# EasyEDA Pro project SCH.eprj

# Schematic Schematic1
Board Name: Board1; Create Date: 2025-12-10; Page Name: P1; Project Name: TestTask; Schematic Name: Schematic1; Update Date: 2025-12-11; Company: EasyEDA.com; Page Size: A4; Version: V1.0
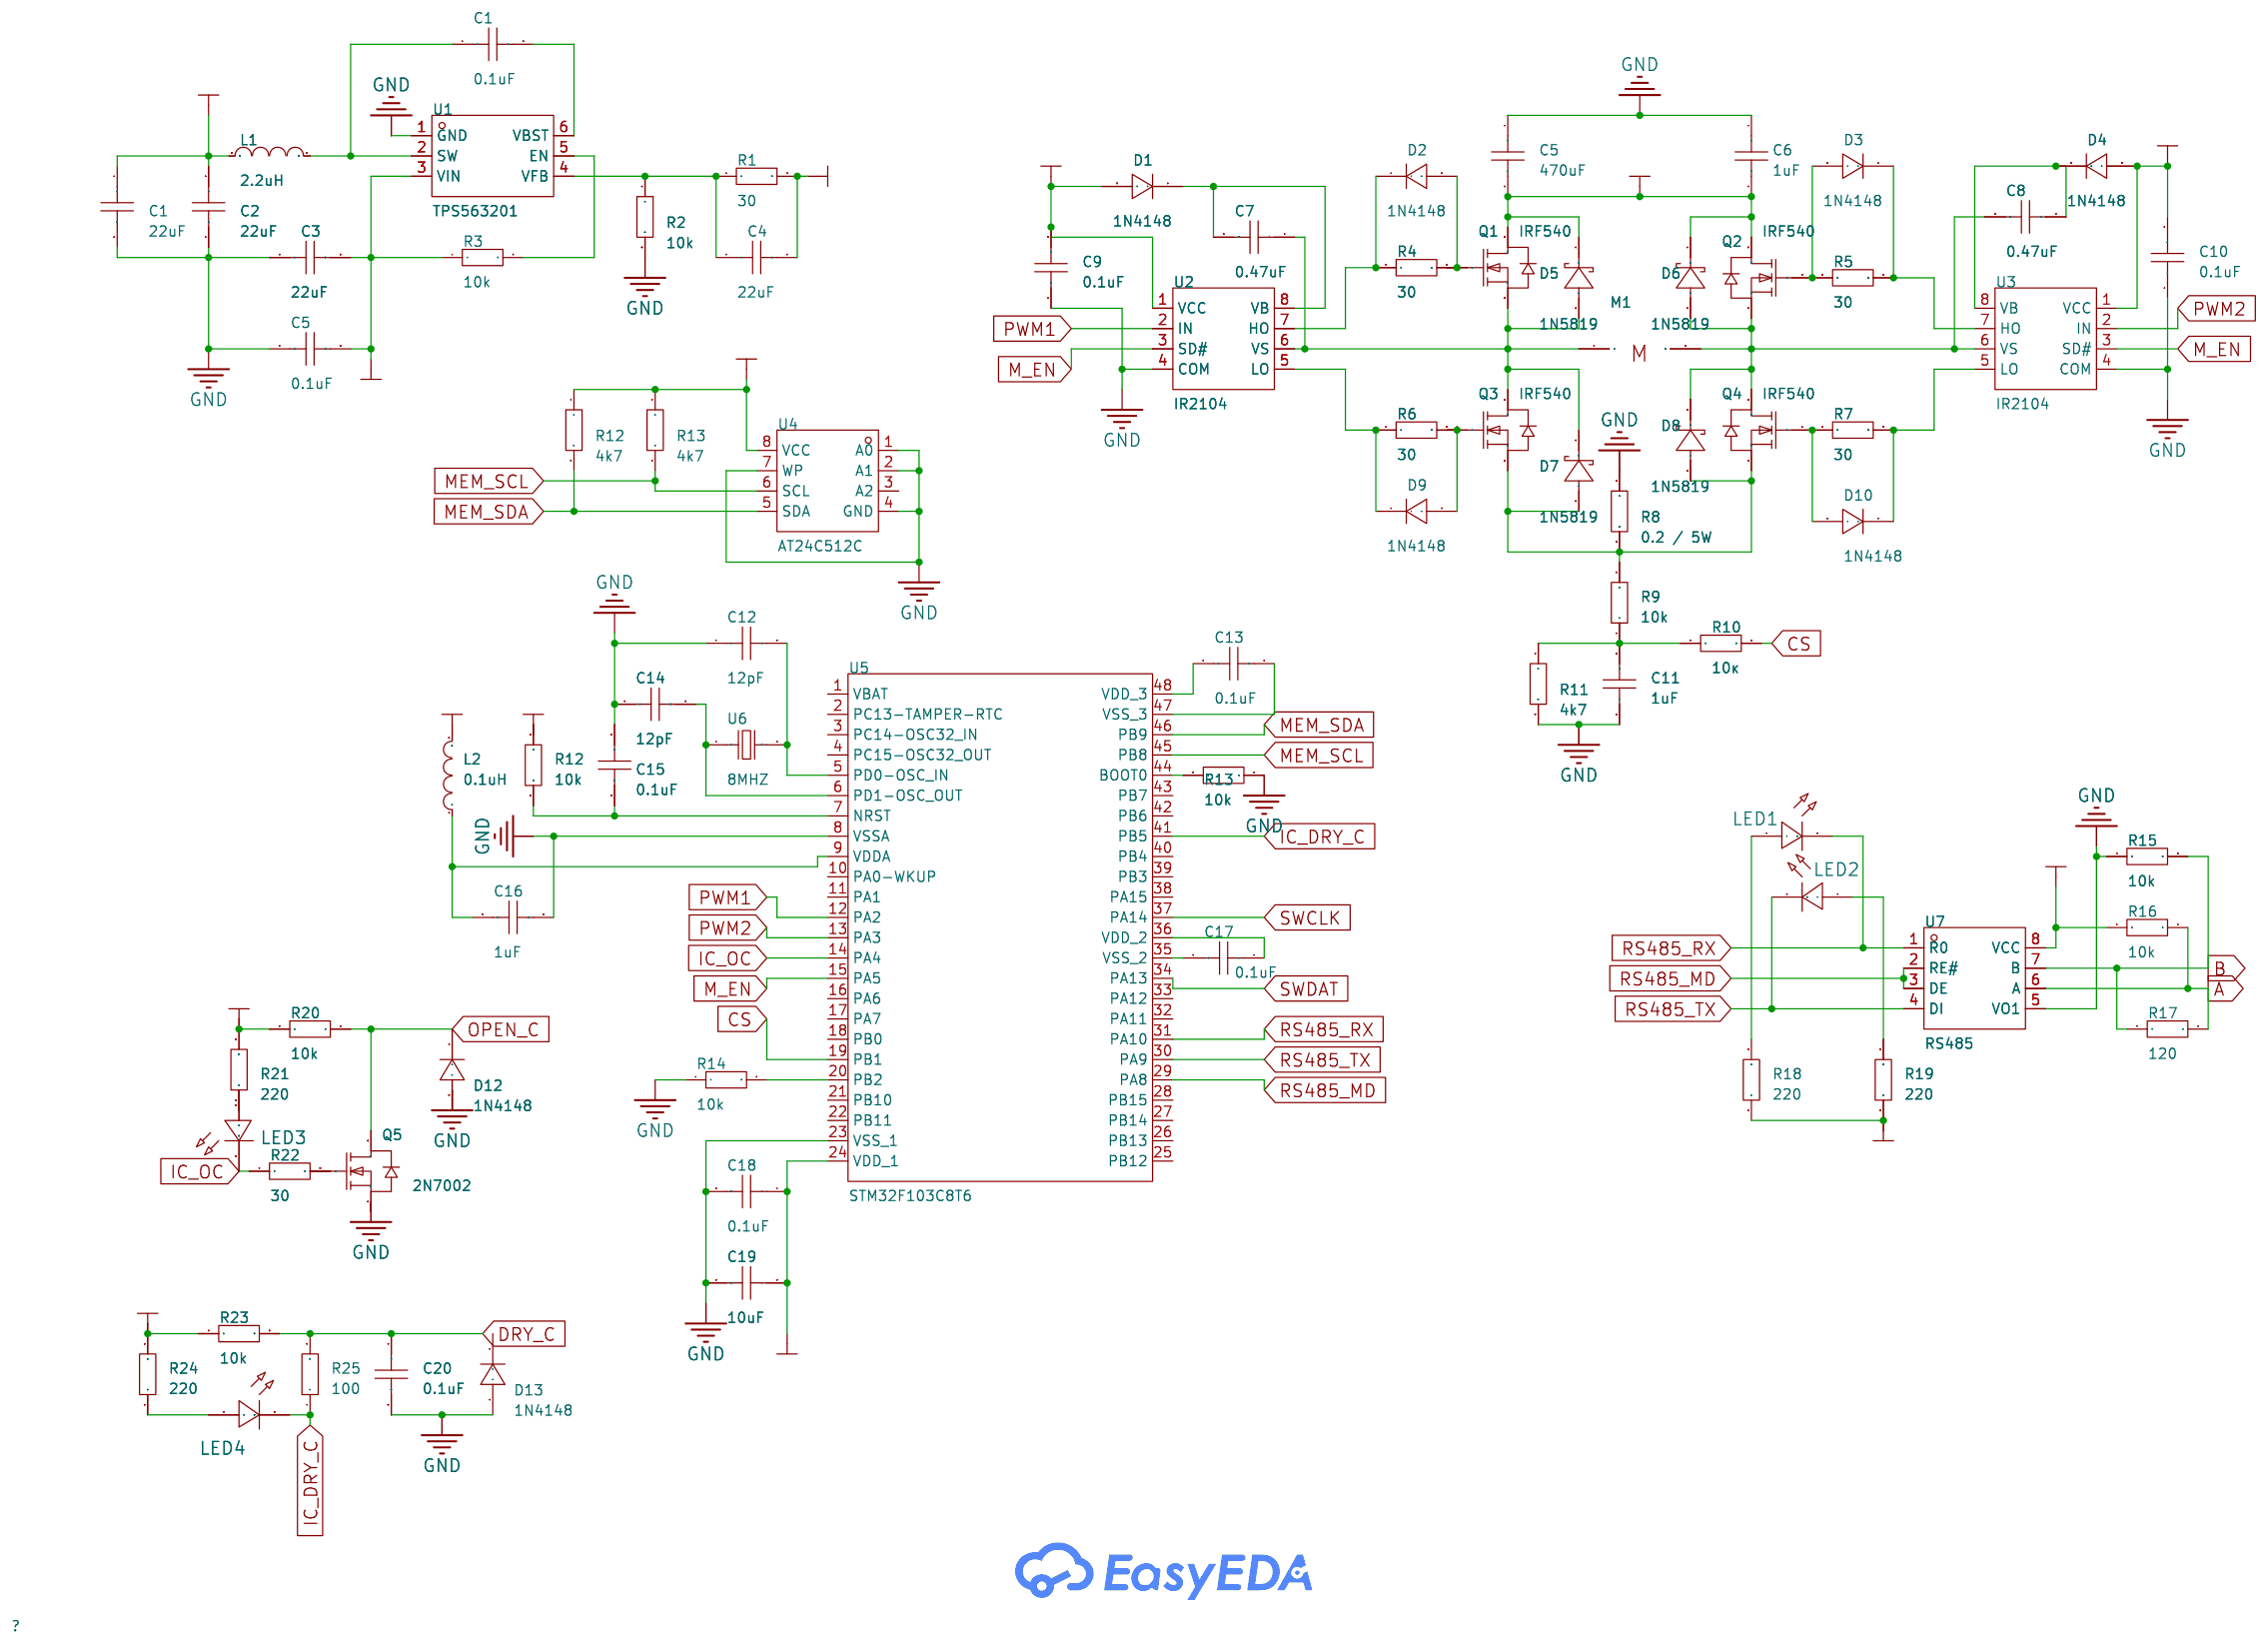
[diagram p0: schematic sheet]

## Parts
C1  0.1uF  [C0201]
C1#2  22uF  [C0201]
C2  22uF  [C0201]
C3  22uF  [C0201]
C4  22uF  [C0201]
C5  470uF  [C0201]
C5#2  0.1uF  [C0201]
C6  1uF  [C0201]
C7  0.47uF  [C0201]
C8  0.47uF  [C0201]
C9  0.1uF  [C0201]
C10  0.1uF  [C0201]
C11  1uF  [C0201]
C12  12pF  [C0201]
C13  0.1uF  [C0201]
C14  12pF  [C0201]
C15  0.1uF  [C0201]
C16  1uF  [C0201]
C17  0.1uF  [C0201]
C18  0.1uF  [C0201]
C19  10uF  [C0201]
C20  0.1uF  [C0201]
D1  1N4148  [SOD-323_L1.8-W1.3-LS2.5-RD]
D2  1N4148  [SOD-323_L1.8-W1.3-LS2.5-RD]
D3  1N4148  [SOD-323_L1.8-W1.3-LS2.5-RD]
D4  1N4148  [SOD-323_L1.8-W1.3-LS2.5-RD]
D5  1N5819  [DO-41_BD2.4-L4.7-P8.70-D0.9-RD]
D6  1N5819  [DO-41_BD2.4-L4.7-P8.70-D0.9-RD]
D7  1N5819  [DO-41_BD2.4-L4.7-P8.70-D0.9-RD]
D8  1N5819  [DO-41_BD2.4-L4.7-P8.70-D0.9-RD]
D9  1N4148  [SOD-323_L1.8-W1.3-LS2.5-RD]
D10  1N4148  [SOD-323_L1.8-W1.3-LS2.5-RD]
D12  1N4148  [SOD-323_L1.8-W1.3-LS2.5-RD]
D13  1N4148  [SOD-323_L1.8-W1.3-LS2.5-RD]
L1  2.2uH  [L0402]
L2  0.1uH  [L0402]
LED1  -  [LED0402-RD_YELLOW]
LED2  -  [LED0402-RD_YELLOW]
LED3  -  [LED0402-RD_YELLOW]
LED4  -  [LED0402-RD_YELLOW]
M1  DC MOTOR
Q1  IRF540  [TO-220F-3_L10.2-W4.5-P2.54-L]
Q2  IRF540  [TO-220F-3_L10.2-W4.5-P2.54-L]
Q3  IRF540  [TO-220F-3_L10.2-W4.5-P2.54-L]
Q4  IRF540  [TO-220F-3_L10.2-W4.5-P2.54-L]
Q5  2N7002  [SOT-23-3_L2.9-W1.3-P1.90-LS2.4-BR]
R1  30  [R0603]
R2  10k  [R0603]
R3  10k  [R0603]
R4  30  [R0603]
R5  30  [R0603]
R6  30  [R0603]
R7  30  [R0603]
R8  0.2 / 5W  [R0603]
R9  10k  [R0603]
R10  10к  [R0603]
R11  4k7  [R0603]
R12  10k  [R0603]
R12#2  4k7  [R0603]
R13  10k  [R0603]
R13#2  4k7  [R0603]
R14  10k  [R0603]
R15  10k  [R0603]
R16  10k  [R0603]
R17  120  [R0603]
R18  220  [R0603]
R19  220  [R0603]
R20  10k  [R0603]
R21  220  [R0603]
R22  30  [R0603]
R23  10k  [R0603]
R24  220  [R0603]
R25  100  [R0603]
U1  TPS563201  [TSOT-23-6_L2.9-W1.6-P0.95-LS2.8-BL]
U2  IR2104  [SOP-8_L4.9-W3.9-P1.27-LS6.0-BL]
U3  IR2104  [SOP-8_L4.9-W3.9-P1.27-LS6.0-BL]
U4  AT24C512C  [SOIJ-8_L5.3-W5.3-P1.27-LS7.9-BL]
U5  STM32F103C8T6  [LQFP-48_L7.0-W7.0-P0.50-LS9.0-BL]
U6  8MHZ  [CRYSTAL-SMD_L3.2-W2.5_3225-8MHZ]
U7  RS485  [SOP-8_L4.9-W3.9-P1.27-LS6.0-BL]

## Library data of the parts
C1 C1#2 C2-C5 C5#2 C6-C20 = CAP_0201: Supplier Footprint: 0201
D1-D4 D9 D10 D12 D13 = 1N4148WS_C2128: LCSC Part Name: 丝印T4 1N4148WS; Supplier Part: C2128; Manufacturer: CJ(江苏长电/长晶); Supplier Footprint: SOD-323; JLCPCB Part Class: Basic Part; Datasheet: https://item.szlcsc.com/datasheet/1N4148WS/2485.html; Supplier: LCSC; Diode Configuration: Independent; Voltage - Forward(Vf@If): 1.25V@150mA; Voltage - DC Reverse(Vr): 100V; Current - Rectified: 150mA; Pd - Power Dissipation: 200mW; Reverse Leakage Current (Ir): 1uA@75V; Reverse Recovery Time (trr): 4ns; Non-Repetitive Peak Forward Surge Current: 2A
D5-D8 = 1N5819_C27636129: LCSC Part Name: 电压:40V 电流:1A; Supplier Part: C27636129; Manufacturer: DOWO(东沃); Supplier Footprint: DO-41; JLCPCB Part Class: Extended Part; Datasheet: https://item.szlcsc.com/datasheet/1N5819/29373164.html; Supplier: LCSC; Voltage - Forward(Vf@If): 600mV@1.0A; Voltage - DC Reverse(Vr): 40V; Current - Rectified: 1A; Operating Junction Temperature Range: -65℃~+125℃; Non-Repetitive Peak Forward Surge Current: 25A
L1 L2 = L_0402
LED1-LED4 = LED_0402-R: Supplier Footprint: 0402
M1 = DC MOTOR
Q1-Q4 = IRF540: LCSC Part Name: N沟道增强型MOSFET,电流:27A,耐压:100V; Supplier Part: C3290454; Manufacturer: onsemi(安森美); Supplier Footprint: TO-220AB; JLCPCB Part Class: Extended Part; Datasheet: https://atta.szlcsc.com/upload/public/pdf/source/20230915/206EF5370A60EAAB29561C2BB62000C4.pdf; Supplier: LCSC; Type: 1 N-channel; RDS(on): 0.07Ω@10V,15A; Gate Threshold Voltage (Vgs(th)@Id): 4V; Input Capacitance(Ciss@Vds): 1.6nF@25V; Reverse Transfer Capacitance (Crss@Vds): 300pF@25V; Operating Temperature: -55℃~+150℃
Q5 = 2N7002_C8545: LCSC Part Name: 1个N沟道 耐压:60V 电流:115mA; Supplier Part: C8545; Manufacturer: CJ(江苏长电/长晶); Supplier Footprint: SOT-23; JLCPCB Part Class: Basic Part; Datasheet: https://item.szlcsc.com/datasheet/2N7002/9040.html; Supplier: LCSC; Number: 1 N-Channel; Drain to Source Voltage: 60V; Current - Continuous Drain(Id): 115mA; RDS(on): 5Ω@10V; Pd - Power Dissipation: 225mW; Gate Threshold Voltage (Vgs(th)): 2.5V; Input Capacitance(Ciss): 50pF; Reverse Transfer Capacitance (Crss@Vds): 5pF
R1-R12 R12#2 R13 R13#2 R14-R25 = Res_0603: Supplier Footprint: 0603
U1 = TPS563201DDCT: LCSC Part Name: 4.5V至17V输入、3A同步降压稳压器; Supplier Part: C2070819; Manufacturer: TI(德州仪器); Supplier Footprint: TSOT-23-6; JLCPCB Part Class: Extended Part; Datasheet: https://www.ti.com/cn/lit/gpn/tps563201; Supplier: LCSC; Function: Buck; Voltage - Supply: 4.5V~17V; Output Voltage: 768mV~7V; Output Current: 3A; Frequency - Switching: 580kHz; Operating Temperature: -40℃~+125℃@(TJ); Synchronous Rectifier: Yes; Number of Outputs: 1; Topology: Buck; Quiescent Current: 520uA; Switch tube (built-in/external): Built-In; Output Type: Adjustable
U2 U3 = IR2104: Supplier Part: C9900008037; Supplier Footprint: SOP-8; JLCPCB Part Class: Extended Part; Supplier: LCSC
U4 = AT24C512C-SHM-B: LCSC Part Name: AT24C512C SHM B; Supplier Part: C1350321; Manufacturer: MICROCHIP(美国微芯); Supplier Footprint: SOIC-8-208mil; JLCPCB Part Class: Extended Part; Datasheet: https://atta.szlcsc.com/upload/public/pdf/source/20210603/C1350321_905A24B02F2435CE8A082F7F1C01EB8C.pdf; Supplier: LCSC; Interface Type: I2C; Memory Size: 512Kbit; Supply Voltage: 1.7V~3.6V; Operating Temperature: -40℃~+85℃
U5 = STM32F103C8T6: LCSC Part Name: 主流增强型ARM Cortex-M3 MCU，具有64 KB Flash、72 MHz CPU、电机控制、USB和CAN; Supplier Part: C8734; Manufacturer: ST(意法半导体); Supplier Footprint: LQFP-48(7x7); JLCPCB Part Class: Extended Part; Datasheet: https://item.szlcsc.com/datasheet/STM32F103C8T6/9243.html; Supplier: LCSC; CPU Core: ARM-M3; CPU Maximum Speed: 72MHz; Program Storage Size: 64KB; Program Memory Type: FLASH; Number of I/O: 37; ADC (Bit): 12bit; Voltage - Supply: 2V~3.6V
U6 = 8MHZ8PF50PPM: Supplier Part: C9900008229; Supplier Footprint: CRYSTAL-SMD_L3.2-W2.5; JLCPCB Part Class: Extended Part; Supplier: LCSC
U7 = RS485: Supplier Part: C19631832; Manufacturer: GR(国睿); Supplier Footprint: SOP-8; JLCPCB Part Class: Extended Part; Datasheet: https://item.szlcsc.com/datasheet/RS485/20927382.html; Supplier: LCSC

## Nets
+3V3: C1#2.1 C2.1 C4.2 C13.2 C18.1 C19.1 L1.1 L2.2 R1.2 R12.2 R12#2.1 R13#2.1 R16.1 R18.1 R19.1 R20.1 R21.2 R23.1 R24.2 U4.8(VCC) U5.24(VDD_1) U5.48(VDD_3) U7.8(VCC)
+12V: C3.2 C5.2 C5#2.2 C6.2 C9.2 C10.2 D1.2(A) D4.2(A) D5.1(C) D6.1(C) Q1.2(D) Q2.2(D) R3.1 U1.3(VIN) U2.1(VCC) U3.1(VCC)
GND: C1#2.2 C2.2 C3.1 C5.1 C5#2.1 C6.1 C9.1 C10.1 C11.1 C12.1 C14.1 C15.1 C16.2 C18.2 C19.2 C20.2 D12.2(A) D13.2(A) Q5.2(S) R2.2 R8.1 R11.2 R13.1 R14.1 R15.1 U1.1(GND) U2.4(COM) U3.4(COM) U4.1(A0) U4.2(A1) U4.4(GND) U4.7(WP) U5.8(VSSA) U5.23(VSS_1) U7.5(VO1)
A: R16.2 R17.2 U7.6(A)
B: R15.2 R17.1 U7.7(B)
CS: R10.2 U5.19(PB1)
DRY_C: C20.1 R23.2 R25.2
IC_DRY_C: LED4.2(C) R25.1 U5.41(PB5)
IC_OC: LED3.2(C) R22.1 U5.14(PA4)
M_EN: U2.3(SD#) U3.3(SD#) U5.15(PA5)
MEM_SCL: R13#2.2 U4.6(SCL) U5.45(PB8)
MEM_SDA: R12#2.2 U4.5(SDA) U5.46(PB9)
OPEN_C: D12.1(K) Q5.3(D) R20.2
PWM1: U2.2(IN) U5.12(PA2)
PWM2: U3.2(IN) U5.13(PA3)
RS485_MD: U5.29(PA8) U7.2(RE#) U7.3(DE)
RS485_RX: LED1.2(C) U5.31(PA10) U7.1(R0)
RS485_TX: LED2.2(C) U5.30(PA9) U7.4(DI)
SWCLK: U5.37(PA14)
SWDAT: U5.34(PA13)
Net-(C1-1): C1.1 L1.2 U1.2(SW)
Net-(C1-2): C1.2 U1.6(VBST)
Net-(C4-1): C4.1 R1.1 R2.1 U1.4(VFB)
Net-(C7-1): C7.1 D5.2(A) D7.1(C) M1.1 Q1.3(S) Q3.2(D) U2.6(VS)
Net-(C7-2): C7.2 D1.1(K) U2.8(VB)
Net-(C8-1): C8.1 D4.1(K) U3.8(VB)
Net-(C8-2): C8.2 D6.2(A) D8.1(C) M1.2 Q2.3(S) Q4.2(D) U3.6(VS)
Net-(C11-2): C11.2 R9.1 R10.1 R11.1
Net-(C12-2): C12.2 U5.5(PD0-OSC_IN) U6.2
Net-(C13-1): C13.1 U5.47(VSS_3)
Net-(C14-2): C14.2 U5.6(PD1-OSC_OUT) U6.1
Net-(C15-2): C15.2 R12.1 U5.7(NRST)
Net-(C16-1): C16.1 L2.1 U5.9(VDDA)
Net-(C17-1): C17.1 U5.36(VDD_2)
Net-(C17-2): C17.2 U5.35(VSS_2)
Net-(D2-1): D2.1(K) R4.1 U2.7(HO)
Net-(D2-2): D2.2(A) Q1.1(G) R4.2
Net-(D3-1): D3.1(K) R5.2 U3.7(HO)
Net-(D3-2): D3.2(A) Q2.1(G) R5.1
Net-(D7-2): D7.2(A) D8.2(A) Q3.3(S) Q4.3(S) R8.2 R9.2
Net-(D9-1): D9.1(K) R6.1 U2.5(LO)
Net-(D9-2): D9.2(A) Q3.1(G) R6.2
Net-(D10-1): D10.1(K) R7.2 U3.5(LO)
Net-(D10-2): D10.2(A) Q4.1(G) R7.1
Net-(LED1-1): LED1.1(A) R18.2
Net-(LED2-1): LED2.1(A) R19.2
Net-(LED3-1): LED3.1(A) R21.1
Net-(LED4-1): LED4.1(A) R24.1
Net-(Q5-1): Q5.1(G) R22.2
Net-(R3-2): R3.2 U1.5(EN)
Net-(R13-2): R13.2 U5.44(BOOT0)
Net-(R14-2): R14.2 U5.20(PB2)

Not connected (* = marked no-connect by the designer): D13 1(K); U4 3(A2); U5 1(VBAT) 2(PC13-TAMPER-RTC) 3(PC14-OSC32_IN) 4(PC15-OSC32_OUT) 10(PA0-WKUP) 11(PA1) 16(PA6) 17(PA7) 18(PB0) 21(PB10) 22(PB11) 25(PB12) 26(PB13) 27(PB14) 28(PB15) 32(PA11) 33(PA12) 38(PA15) 39(PB3) 40(PB4) 42(PB6) 43(PB7)
